# EAGLE schematic signal-generator (EAGLE 7.2.0)
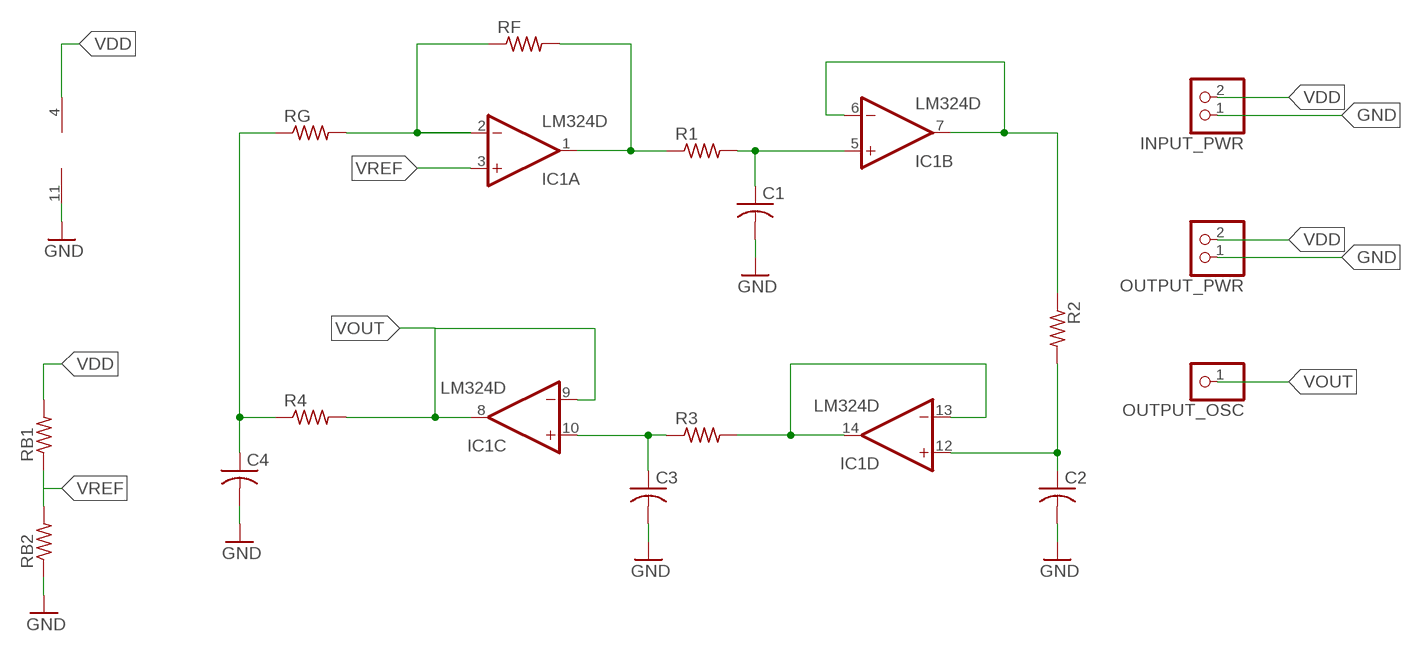
[diagram p0: schematic, sheet 1]

## Parts
C1  C-USC0805  [C0805]
C2  C-USC0805  [C0805]
C3  C-USC0805  [C0805]
C4  C-USC0805  [C0805]
IC1  LM324D  [SO14]
INPUT_PWR  PINHD-1X2/90  [1X02/90]
OUTPUT_OSC  PINHD-1X1  [1X01]
OUTPUT_PWR  PINHD-1X2/90  [1X02/90]
R1  R-US_R0805  [R0805]
R2  R-US_R0805  [R0805]
R3  R-US_R0805  [R0805]
R4  R-US_R0805  [R0805]
RB1  R-US_R0805  [R0805]
RB2  R-US_R0805  [R0805]
RF  R-US_R0805  [R0805]
RG  R-US_R0805  [R0805]

## Nets
GND: C1.2 C2.2 C3.2 C4.2 IC1.11(P:V-) INPUT_PWR.1 OUTPUT_PWR.1 RB2.1
N$1: IC1.2(A:-IN) RF.1 RG.2
N$2: IC1.6(B:-IN) IC1.7(B:OUT) R2.1
N$3: C1.1 IC1.5(B:+IN) R1.2
N$4: IC1.13(D:-IN) IC1.14(D:OUT) R3.2
N$5: C2.1 IC1.12(D:+IN) R2.2
N$6: C4.1 R4.1 RG.1
N$8: IC1.1(A:OUT) R1.1 RF.2
N$9: C3.1 IC1.10(C:+IN) R3.1
VDD: IC1.4(P:V+) INPUT_PWR.2 OUTPUT_PWR.2 RB1.2
VOUT: IC1.8(C:OUT) IC1.9(C:-IN) OUTPUT_OSC.1 R4.2
VREF: IC1.3(A:+IN) RB1.1 RB2.2

## Library data of the parts
C1-C4 = rcl:C-US: CAPACITOR, American symbol
IC1 = linear:LM324: OP AMP
INPUT_PWR OUTPUT_PWR = pinhead:PINHD-1X2: PIN HEADER
OUTPUT_OSC = pinhead:PINHD-1X1: PIN HEADER
R1-R4 RB1 RB2 RF RG = rcl:R-US_: RESISTOR, American symbol